# EAGLE design Thermal_Stage_rev (EAGLE 5.06)
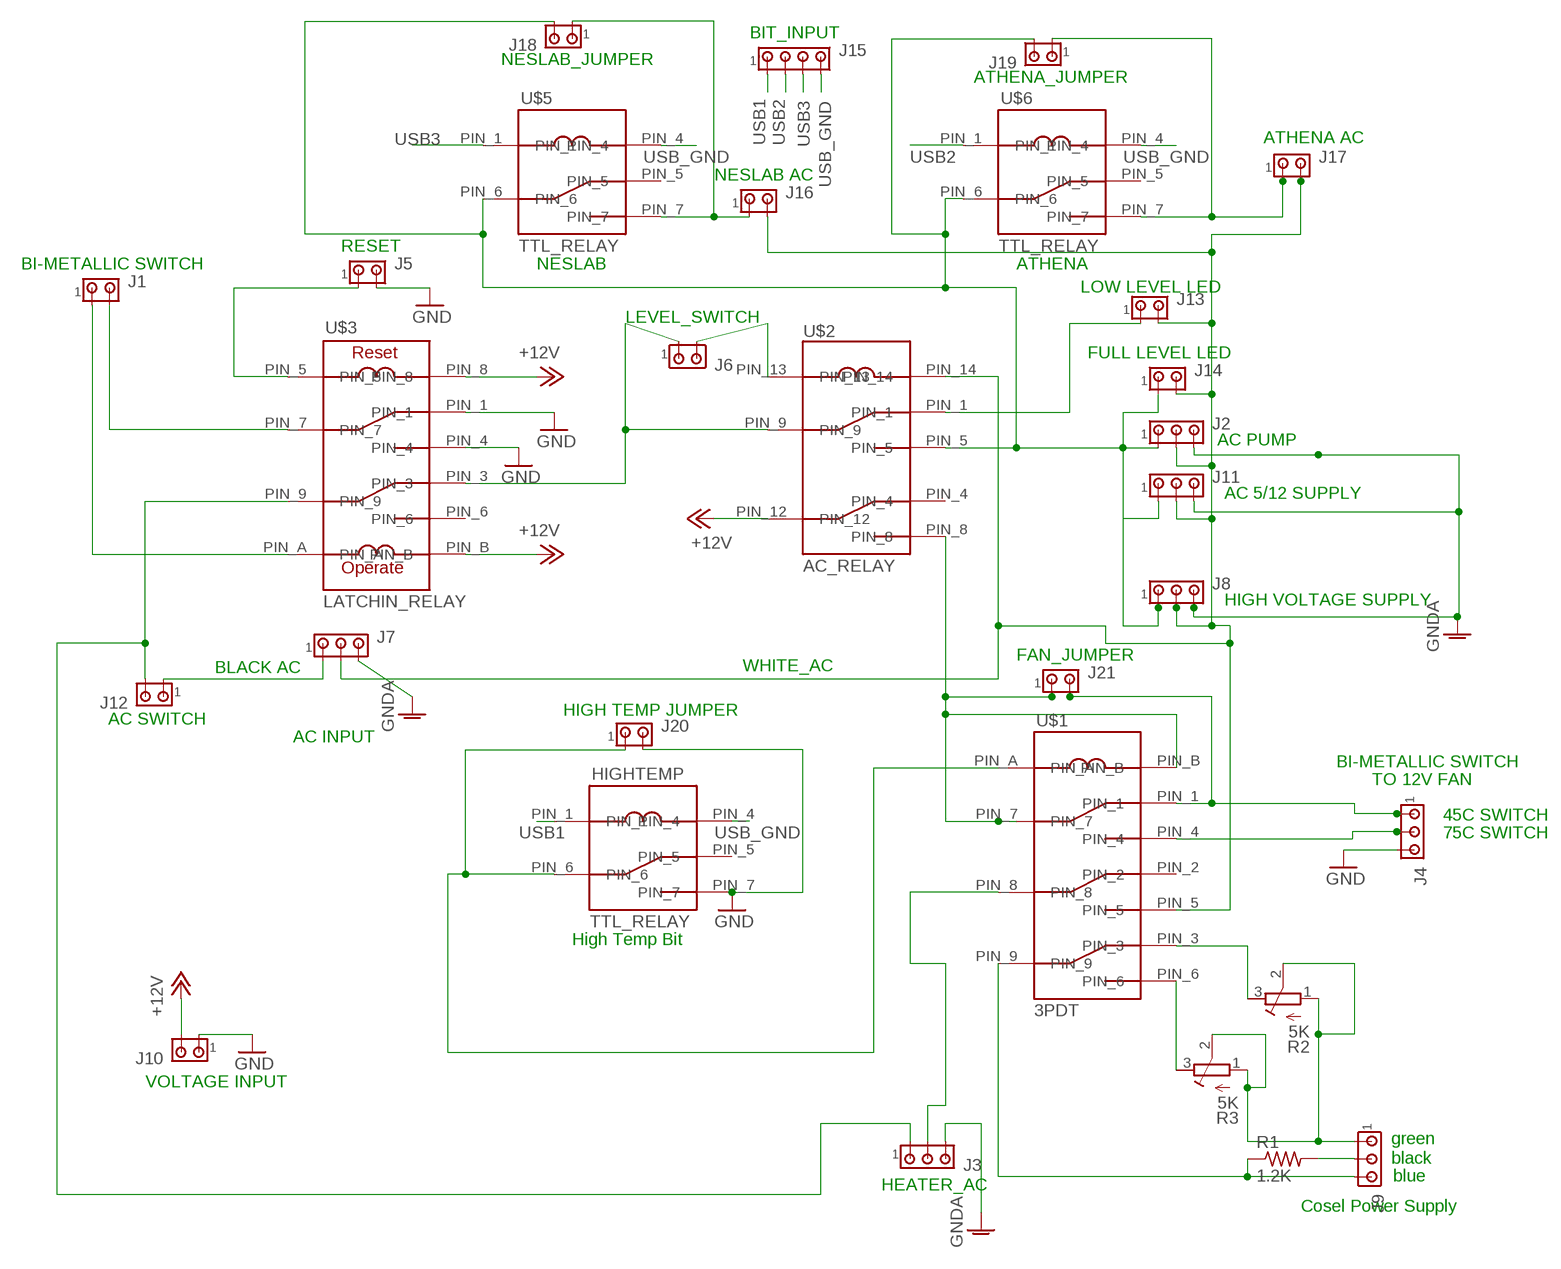
[diagram p0: schematic, sheet 1]

## Parts
HIGHTEMP  TTL_RELAY  [R1OS-E1Y1-J1.0K]
J1  MTA02-156  [1X2MTA]
J2  MTA03-156  [1X3MTA]
J3  MTA03-156  [1X3MTA]
J4  MTA03-156  [1X3MTA]
J5  MTA02-156  [1X2MTA]
J6  MTA02-156  [1X2MTA]
J7  MTA03-156  [1X3MTA]
J8  MTA03-156  [1X3MTA]
J9  MTA03-100  [10X03MTA]
J10  MTA02-156  [1X2MTA]
J11  MTA03-156  [1X3MTA]
J12  MTA02-156  [1X2MTA]
J13  MTA02-156  [1X2MTA]
J14  MTA02-156  [1X2MTA]
J15  MTA04-100  [10X04MTA]
J16  MTA02-156  [1X2MTA]
J17  MTA02-156  [1X2MTA]
J18  MTA02-100  [10X02MTA]
J19  MTA02-100  [10X02MTA]
J20  MTA02-100  [10X02MTA]
J21  MTA02-100  [10X02MTA]
R1  1.2K  R-US_0207/7  [0207/7]
R2  5K  R-TRIMM3296W  [RTRIM3296W]
R3  5K  R-TRIMM3296W  [RTRIM3296W]
U$1  3PDT  [785XBXCD-12D]
U$2  AC_RELAY  [70-402-1]
U$3  LATCHIN_RELAY  [785XBXCD-12D]
U$5  TTL_RELAY  [R1OS-E1Y1-J1.0K]
U$6  TTL_RELAY  [R1OS-E1Y1-J1.0K]

## Nets
+12V: J10.2 U$2.PIN_12 U$3.PIN_8 U$3.PIN_B
BLACK_AC: J7.1 J12.1
BLACK_AC_SWITCH: J3.1 J12.2 U$3.PIN_9
GND: HIGHTEMP.PIN_7 J4.3 J5.2 J10.1 J20.2 U$3.PIN_1 U$3.PIN_4
GNDA: J2.3 J3.3 J7.3 J8.3 J11.3
N$1: J1.2 U$3.PIN_7
N$2: J1.1 U$3.PIN_A
N$4: J5.1 U$3.PIN_5
N$6: J6.1 U$2.PIN_9 U$3.PIN_3
N$8: J2.1 J8.1 J11.1 J14.1 J18.2 J19.2 U$2.PIN_5 U$5.PIN_6 U$6.PIN_6
N$9: J13.1 U$2.PIN_1
N$10: J3.2 U$1.PIN_8
N$11: J6.2 U$2.PIN_13
N$13: HIGHTEMP.PIN_6 J20.1 U$1.PIN_A
N$14: J17.1 J19.1 U$6.PIN_7
N$15: J16.1 J18.1 U$5.PIN_7
N$16: J9.3 R1.1 U$1.PIN_9
N$17: J4.2 U$1.PIN_4
N$18: J4.1 J21.2 U$1.PIN_1
N$19: J9.2 R1.2
N$20: R3.3(A) U$1.PIN_6
N$21: R2.3(A) U$1.PIN_3
N$22: J9.1 R2.1(E) R2.2(S) R3.1(E) R3.2(S)
N$23: J21.1 U$1.PIN_7 U$1.PIN_B U$2.PIN_8
USB1: HIGHTEMP.PIN_1 J15.1
USB2: J15.2 U$6.PIN_1
USB3: J15.3 U$5.PIN_1
USB_GND: HIGHTEMP.PIN_4 J15.4 U$5.PIN_4 U$6.PIN_4
WHITE_AC: J2.2 J7.2 J8.2 J11.2 J13.2 J14.2 J16.2 J17.2 U$1.PIN_5 U$2.PIN_14
Unconnected: HIGHTEMP.PIN_5 U$1.PIN_2 U$2.PIN_4 U$3.PIN_6 U$5.PIN_5 U$6.PIN_5

## Notes on the sheet
- BIT_INPUT
- NESLAB_JUMPER
- ATHENA_JUMPER
- ATHENA AC
- NESLAB AC
- RESET
- BI-METALLIC SWITCH | NESLAB | ATHENA
- LOW LEVEL LED
- LEVEL_SWITCH
- FULL LEVEL LED
- AC PUMP
- AC 5/12 SUPPLY
- HIGH VOLTAGE SUPPLY
- FAN_JUMPER
- BLACK AC | WHITE_AC
- HIGH TEMP JUMPER
- AC SWITCH
- AC INPUT
- BI-METALLIC SWITCH
- TO 12V FAN
- 45C SWITCH
- 75C SWITCH
- High Temp Bit
- VOLTAGE INPUT
- green
- black
- blue
- HEATER_AC
- Cosel Power Supply

## Library data of the parts
HIGHTEMP U$5 U$6 = Anthony-Relay:TTL_RELAY
J1 J5 J6 J10 J12-J14 J16 J17 = con-amp:MTA02-156: AMP connector; OC_FARNELL: unknown; OC_NEWARK: unknown
J2-J4 J7 J8 J11 = con-amp:MTA03-156: AMP connector; OC_FARNELL: unknown; OC_NEWARK: unknown
J9 = con-amp:MTA03-100: AMP connector; OC_FARNELL: unknown; OC_NEWARK: unknown
J15 = con-amp:MTA04-100: AMP connector; OC_FARNELL: unknown; OC_NEWARK: unknown
J18-J21 = con-amp:MTA02-100: AMP connector; OC_FARNELL: unknown; OC_NEWARK: unknown
R1 = rcl:R-US_: RESISTOR, American symbol
R2 R3 = resistor:R-TRIMM: Trimm resistor
U$1 = Anthony-Relay:3PDT
U$2 = Anthony-Relay:AC_RELAY
U$3 = Anthony-Relay:LATCHIN_RELAY

## Board
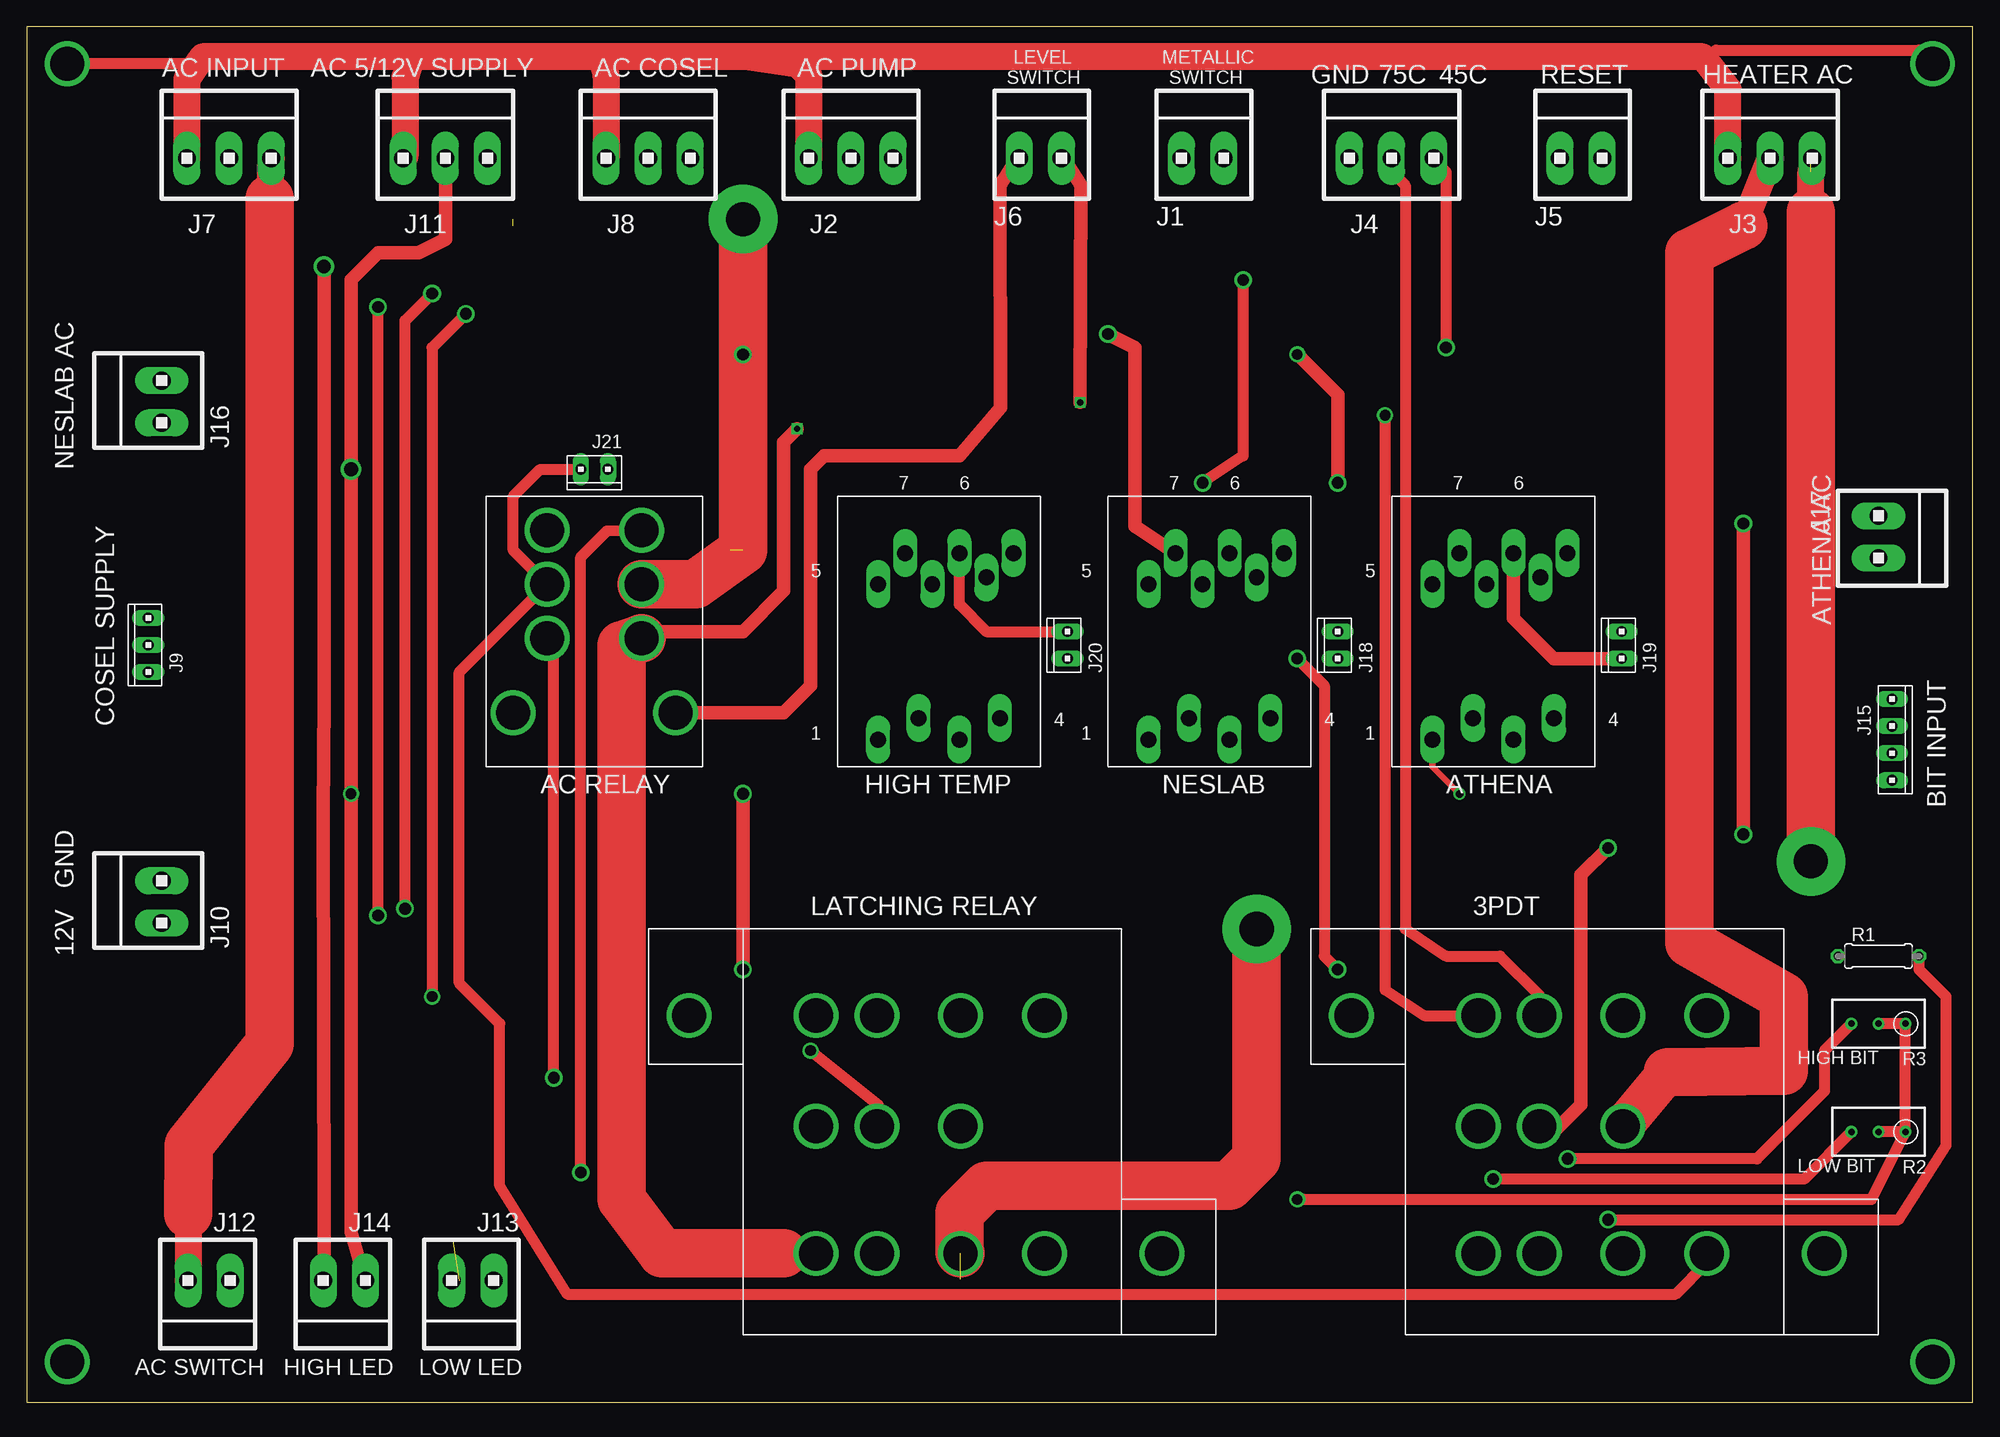
[diagram p1: board, top side]
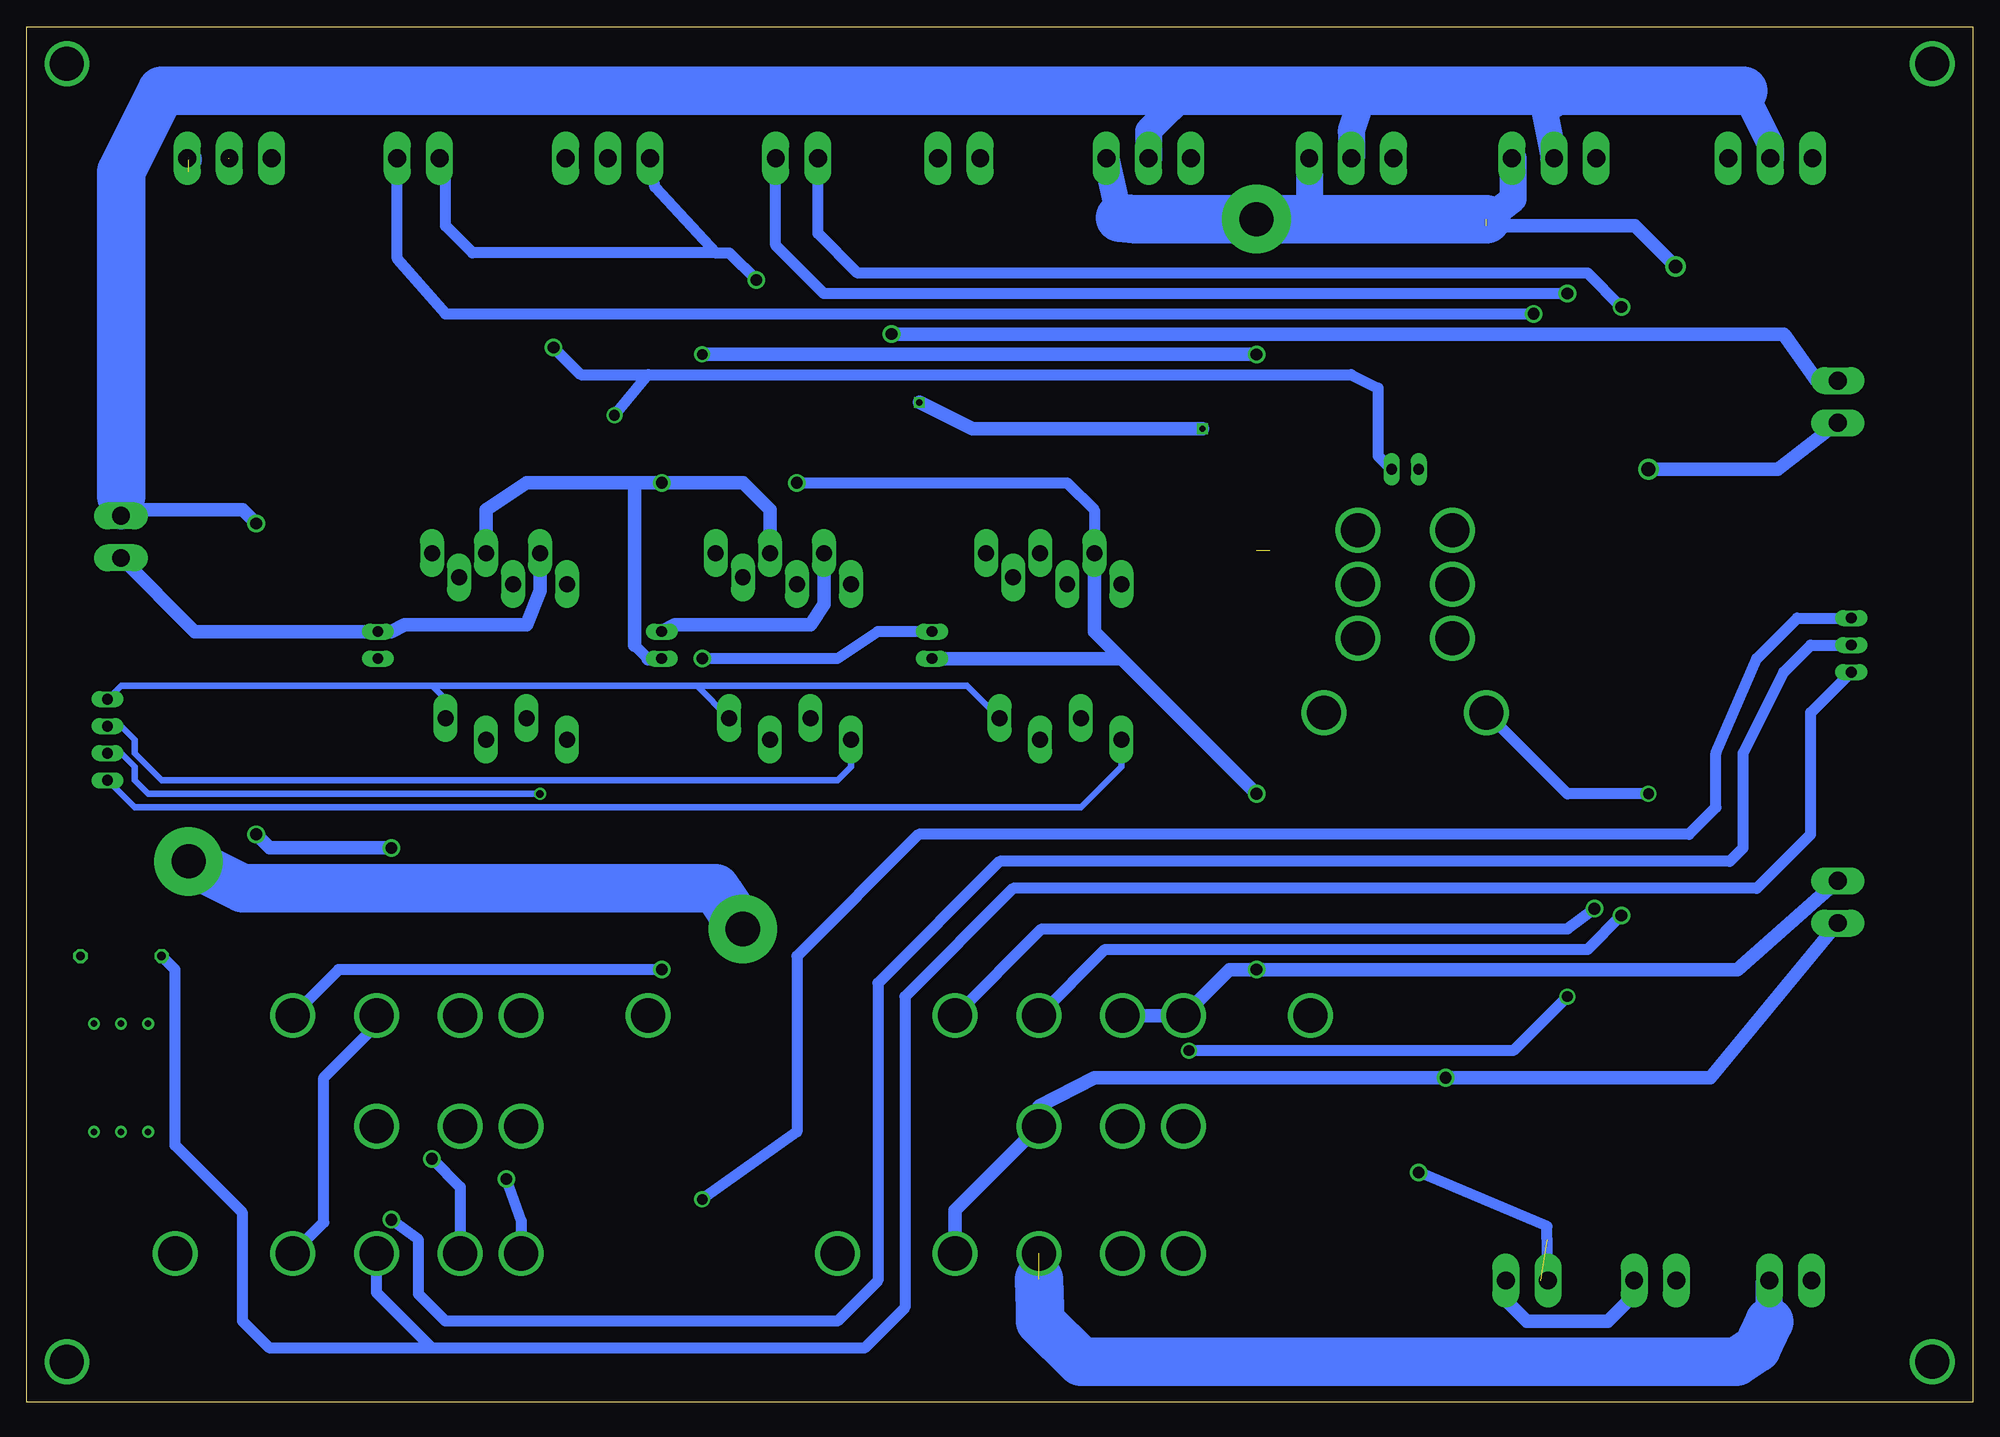
[diagram p2: board, bottom side, seen from below]

Size 182.86 x 129.21 mm. Coordinates in mm from the lower left corner, seen from the top.
Outline: 0,0 182.86,0 182.86,129.21 0,129.21 0,0
Copper layers (1*16): Top 0.035mm / dielectric 1.5mm / Bottom 0.035mm
Design rules "default": minimum track width 10mil, minimum drill 24mil, track to track 8mil, track to pad 8mil, pad to pad 8mil, via to via 8mil, smd to smd 8mil, copper to edge 40mil, drill to drill 8mil, minimum pad ring 10mil, minimum via ring 8mil, stop-mask expansion 4mil, vias tented up to drill 0mil, thermal gap 10mil

### Footprints (pad centres in the part's own frame; a part is rotated, then mirrored left to right if it is on the bottom)
R1OS-E1Y1-J1.0K = drill 1.5 long: 89 8.89,17.145; P$2 7.62,4.572; P$3 11.43,2.54; P$9 13.97,17.78; P$10 16.51,20.066; PIN_1 3.81,2.54; PIN_4 15.24,4.572; PIN_5 3.81,17.145; PIN_6 11.43,20.066; PIN_7 6.35,20.066
1X2MTA = drill 1.676 long: 1 1.981,0; 2 -1.981,0
1X3MTA = drill 1.676 long: 1 3.937,0; 2 -0.025,0; 3 -3.988,0
10X03MTA = drill 1.016 long: 1 2.54,0; 2 0,0; 3 -2.54,0
10X04MTA = drill 1.016 long: 1 3.81,0; 2 1.27,0; 3 -1.27,0; 4 -3.81,0
10X02MTA = drill 1.016 long: 1 1.27,0; 2 -1.27,0
0207/7 = drill 0.813 octagon: 1 -3.81,0; 2 3.81,0
RTRIM3296W = drill 0.61 round: 1 0,-2.54; 2 0,0; 3 0,2.54
785XBXCD-12D = drill 3.2 round: P$6 7.62,-3.81; P$14 29.972,40.64; PIN_1 29.972,28.702; PIN_2 19.558,28.702; PIN_3 7.62,28.702; PIN_4 29.972,22.987; PIN_5 19.558,22.987; PIN_6 7.62,22.987; PIN_7 29.972,15.113; PIN_8 19.558,15.113; PIN_9 7.62,15.113; PIN_A 29.972,7.239; PIN_B 7.62,7.239
70-402-1 = drill 3.2 round: PIN_1 5.715,3.175; PIN_4 14.605,3.175; PIN_5 5.715,8.255; PIN_8 14.605,8.255; PIN_9 5.715,13.335; PIN_12 14.605,13.335; PIN_13 2.54,20.32; PIN_14 17.78,20.32

### Placement (x,y rotation side)
HIGHTEMP  76.2,59.69 0 top
J1  110.49,116.84 0 top
J2  77.47,116.84 0 top
J3  163.83,116.84 0 top
J4  128.27,116.84 0 top
J5  146.05,116.84 0 top
J6  95.25,116.84 0 top
J7  19.05,116.84 0 top
J8  58.42,116.84 0 top
J9  11.43,71.12 90 top
J10  12.7,46.99 90 top
J11  39.37,116.84 0 top
J12  17.14,11.43 180 top
J13  41.91,11.43 180 top
J14  29.84,11.43 180 top
J15  175.26,62.23 270 top
J16  12.7,93.98 90 top
J17  173.99,81.28 270 top
J18  123.19,71.12 90 top
J19  149.86,71.12 90 top
J20  97.79,71.12 90 top
J21  53.34,87.63 180 top
R1  173.99,41.91 0 top
R2  173.99,25.4 90 top
R3  173.99,35.56 90 top
U$1  165.1,6.35 90 top
U$2  63.5,85.09 180 top
U$3  102.87,6.35 90 top
U$5  101.6,59.69 0 top
U$6  128.27,59.69 0 top

### Tracks (layer width: path | path; a pad name or v marks a point on that pad's centre or on a via)
+12V  (via drill 1.1)
  Top 1.016: U$2.PIN_12 49.53,71.12 v49.53,30.48
  Bottom 1.27: J10.2 24.69,30.48 v49.53,30.48 82.55,30.48 87.76,27.81 U$3.PIN_8 95.63,18.03 U$3.PIN_B
BLACK_AC
  Top 2.54: 22.86,113.03 J7.1 | 15.16,17.7 J12.1
  Top 4.572: 22.86,113.03 22.86,33.66 15.24,24.13 15.16,17.7
BLACK_AC_SWITCH  (via drill 3.2 pad 6.45)  (2 unrouted)
  Top 2.54: 167.64,111.76 167.64,115.57
  Top 4.572: 167.64,111.76 v167.64,50.8 | v115.57,44.45 115.57,22.86 113.03,20.32 90.17,20.32 87.63,17.78 87.63,14.1 U$3.PIN_9
  Bottom 2.54: 19.13,7.54 J12.2 | 167.64,116.71 J3.1
  Bottom 4.572: 19.13,7.54 20.32,5.08 22.23,3.81 83.82,3.81 87.63,7.62 87.63,8.89 87.76,11.56 | v115.57,44.45 118.11,48.26 162.56,48.26 v167.64,50.8
GND  (via drill 1.1)
  Top 1.016: v114.3,105.41 114.3,88.9 v110.49,86.36
  Top 1.27: v67.31,57.15 v67.31,40.64
  Bottom 1.016: J4.3 123.83,114.12 118.11,107.95 | 118.11,107.95 116.84,107.95 v114.3,105.41 | v110.49,86.36 85.09,86.36 82.55,83.82 HIGHTEMP.PIN_7 | J5.2 143.51,116.84 143.51,110.49 140.97,107.95 118.11,107.95
  Bottom 1.27: J10.1 22.15,40.64 v67.31,40.64 69.85,40.64 U$3.PIN_1 U$3.PIN_4 | HIGHTEMP.PIN_7 82.55,72.39 80.01,69.85 | 80.01,69.85 v67.31,57.15 | 80.01,69.85 J20.2
GNDA
  Top 2.54: J7.3 15.06,124.28 16.51,126.36 36.2,126.36 | 36.2,126.36 35.56,124.46 35.56,117.02 J11.3 | J8.3 54.43,124.64 53.98,126.36 | 53.98,126.36 36.2,126.36 | J2.3 73.48,124.64 72.39,125.73 67.94,126.36 | 67.94,126.36 53.98,126.36 | J3.3 159.84,123.37 157.48,126.36 67.94,126.36
N$1  (via drill 1.1)
  Top 1.016: v33.02,45.72 v33.02,102.87
  Bottom 1.016: U$3.PIN_7 81.53,42.55 36.2,42.55 v33.02,45.72 | v33.02,102.87 36.2,106.05 104.78,106.05 108.51,109.78 J1.2
N$2  (via drill 1.1)
  Top 1.016: v35.56,46.35 35.56,101.6 v38.1,104.14
  Bottom 1.016: U$3.PIN_A 87.5,44.45 38.1,44.45 v35.56,46.35 | v38.1,104.14 107.95,104.14 112.47,108.66 J1.1
N$4  (via drill 1, 1.1)
  Top 1.016: v73.66,33.02 80.01,27.94 80.01,26.04 U$3.PIN_5 | v38.1,38.1 38.1,99.06 v41.27,102.23
  Bottom 1.016: v73.66,33.02 43.18,33.02 v38.1,38.1 | v41.27,102.23 143.51,102.23 148.03,107.39 J5.1
N$6  (via drill 0.6)
  Top 1.27: 57.15,71.12 U$2.PIN_9 58.42,72.39 67.31,72.39 71.12,76.2 71.12,90.17 v72.39,91.44 | v98.98,93.9 99.06,114.3 97.79,116.28 J6.1
  Top 2.54: 71.12,13.97 U$3.PIN_3
  Top 4.572: 71.12,13.97 59.69,13.97 55.88,19.05 55.88,71.12 U$2.PIN_9
  Bottom 1.27: v98.98,93.9 93.98,91.44 v72.39,91.44
N$8  (via drill 1, 1.1, 1.3, 3.2 pad 6.45)  (2 unrouted)
  Top 1.27: J14.1 27.94,11.43 27.94,15.24 | 27.94,15.24 27.94,15.88 | 27.94,15.24 27.94,16.51 27.86,55.17 27.94,66.04 v27.94,106.68 | v119.38,98.42 123.19,94.61 123.19,91.44 v123.19,86.36 | J19.2 143.51,69.85 139.7,73.66 U$6.PIN_6
  Top 4.572: v67.31,111.12 v67.31,98.42 67.31,80.01 62.87,76.83 U$2.PIN_5
  Bottom 1.016: 125.73,71.12 124.46,69.85
  Bottom 1.27: 43.18,116.84 J11.1 | v27.94,106.68 31.75,110.49 45.72,110.49 | U$6.PIN_6 139.7,83.82 135.89,86.36 125.73,86.36 | 125.73,86.36 v123.19,86.36 115.57,86.36 113.03,83.82 U$5.PIN_6 | v67.31,98.42 v119.38,98.42 | 124.46,69.85 J18.2 | 125.73,86.36 125.73,71.12
  Bottom 2.54: 62.23,111.12 J8.1 | 80.14,111.25 J2.1 | 43.18,116.84 43.18,113.03 45.72,111.12
  Bottom 4.572: 62.23,111.12 v67.31,111.12 78.74,111.12 80.14,111.25 | 62.23,111.12 45.72,111.12 | 62.23,111.12 64.77,111.12
N$9  (via drill 1.1)  (1 unrouted)
  Top 1.016: v52.07,21.59 52.07,79.38 54.53,81.84 56.52,81.92 U$2.PIN_1
  Bottom 1.016: 40.01,15.32 40.01,16.51 v52.07,21.59 | 40.01,15.32 40.01,15.24 | 40.01,15.32 40.01,11.51 J13.1
N$10  (1 unrouted)
  Top 2.54: J3.2 163.83,116.84 | 161.29,110.49 163.83,116.81
  Top 3.81: 154.18,30.99 U$1.PIN_8
  Top 4.572: 154.18,30.99 165.1,31.11 165.1,38.1 156.21,43.18 156.21,107.95 161.29,110.49
N$11
  Top 1.27: J6.2 92.71,116.28 91.44,114.3 91.52,93.42 87.63,88.9 74.93,88.9 73.66,87.63 73.66,67.31 71.12,64.77 U$2.PIN_13
N$13  (via drill 1.1)
  Top 1.016: HIGHTEMP.PIN_6 87.63,74.93 90.17,72.39 J20.1 | v119.38,69.85 121.92,67.31 121.92,41.91 v123.19,40.64
  Bottom 1.016: J20.1 102.87,72.39 106.68,69.85 v119.38,69.85 | v123.19,40.64 153.54,40.64 U$1.PIN_A
N$14
  Bottom 1.27: J17.1 167.08,72.39 J19.1 148.59,72.39 147.32,73.03 135.89,73.03 134.62,76.2 U$6.PIN_7
N$15  (via drill 1.1)
  Top 1.27: U$5.PIN_7 104.14,82.3 104.14,99.06 v101.6,100.33
  Bottom 1.27: J18.1 121.92,73.03 109.22,73.03 107.95,74.93 U$5.PIN_7 | v101.6,100.33 17.78,100.33 14.68,95.96 J16.1
N$16
  Bottom 1.016: J9.3 15.24,64.77 15.24,53.34 20.32,48.26 90.17,48.26 100.33,38.1 100.33,8.89 104.14,5.08 142.24,5.08 | 142.24,5.08 144.78,5.08 149.99,10.29 U$1.PIN_9 | R1.1 168.91,40.64 168.91,24.13 162.56,17.78 162.56,7.62 160.02,5.08 142.24,5.08
N$17
  Top 1.016: J4.2 128.27,116.81 128.27,115.57 129.54,114.3 129.54,44.45 133.35,41.91 138.43,41.91 142.11,38.23 U$1.PIN_4
N$18  (via drill 1, 1.1)
  Top 1.016: v127.64,92.71 127.64,38.73 131.32,36.32 U$1.PIN_1 | J4.1 132.08,116.84 133.35,115.57 v133.35,99.06
  Bottom 1.016: J21.2 55.88,88.9 55.88,95.25 58.42,96.52 124.46,96.52 | 124.46,96.52 v127.64,92.71 | v133.35,99.06 130.81,96.52 124.46,96.52
N$19  (via drill 1.1)
  Top 1.016: v148.59,17.14 175.9,17.14 180.34,24.13 180.34,38.1 177.8,40.64 R1.2
  Bottom 1.016: J9.2 15.24,71.12 17.78,68.58 21.59,60.96 21.59,52.07 22.86,50.8 91.44,50.8 102.87,39.37 102.87,11.43 106.68,7.62 143.51,7.62 146.05,10.16 146.05,15.24 v148.59,17.14
N$20  (via drill 1.1)
  Top 1.016: R3.3 168.91,33.02 168.91,29.21 162.56,22.86 v144.78,22.86
  Bottom 1.016: v144.78,22.86 142.11,20.19 U$1.PIN_6
N$21  (via drill 1.1)
  Top 1.016: R2.3 167,20.95 v137.79,20.95
  Bottom 1.016: v137.79,20.95 136.4,17.02 U$1.PIN_3
N$22  (via drill 1)
  Top 1.016: v119.38,19.05 173.35,19.05 R2.1 | R2.1 R3.1 R3.2 | R2.1 R2.2
  Bottom 1.016: J9.1 16.51,73.66 20.32,69.85 24.13,60.96 24.13,55.88 26.67,53.34 99.06,53.34 110.49,41.91 110.49,25.4 v119.38,19.05
N$23
  Top 1.016: U$1.PIN_B 157.86,13.08 154.94,10.16 50.8,10.16 44.45,20.32 44.45,35.56 40.64,39.37 40.64,68.58 U$2.PIN_8 45.72,80.01 45.72,85.09 48.26,87.63 J21.1
  Bottom 1.016: U$1.PIN_B 154.94,16.89 154.94,30.48 149.99,35.43 U$1.PIN_7
S$1  (via drill 3.2 pad 1.27)
  other vias: 179.07,125.73
S$2  (via drill 3.2 pad 1.27)
  other vias: 3.81,125.73
S$3  (via drill 3.2 pad 1.27)
  other vias: 3.81,3.81
S$4  (via drill 3.2 pad 1.27)
  other vias: 179.07,3.81
S$5
  Top 1.016: 15.24,125.73 5.08,125.73
S$6
  Top 1.016: 158.75,127 177.8,127
USB1
  Bottom 0.61: J15.1 172.72,55.88 83.82,55.88 80.01,59.69 HIGHTEMP.PIN_1
USB2  (via drill 0.7)
  Top 0.61: v134.62,57.15 132.08,59.69 U$6.PIN_1
  Bottom 0.61: J15.2 173.99,60.96 172.72,59.69 172.72,58.42 171.45,57.15 v134.62,57.15
USB3
  Bottom 0.61: J15.3 173.99,63.5 172.72,62.23 172.72,60.96 170.18,58.42 106.68,58.42 105.41,59.69 U$5.PIN_1
USB_GND
  Bottom 0.61: J15.4 173.99,67.31 144.78,67.31 | 144.78,67.31 143.51,66.04 U$6.PIN_4 | U$5.PIN_4 119.89,67.31 120.65,67.31 | 120.65,67.31 144.78,67.31 | HIGHTEMP.PIN_4 94.49,67.31 120.65,67.31
WHITE_AC  (via drill 1, 1.1, 1.3)
  Top 1.016: 39.37,114.3 39.37,116.81 J11.2
  Top 1.27: v161.29,82.55 v161.29,53.34 | v148.59,52.07 146.05,49.53 146.05,27.94 143.51,25.4 142.24,25.4 142.11,25.53 U$1.PIN_5 | J14.2 30.48,15.95 v30.48,57.15 v30.48,87.63 30.48,105.41 33.02,107.95 36.83,107.95 39.37,109.22 39.37,114.3
  Bottom 1.016: U$2.PIN_14 38.1,57.15 v30.48,57.15
  Bottom 1.27: J17.2 173.43,83.82 162.56,83.82 v161.29,82.55 | v161.29,53.34 160.02,52.07 v148.59,52.07 | J2.2 77.47,116.84 | 58.42,119.38 58.4,119.36 | J16.2 18.34,87.63 v30.48,87.63 | J14.2 31.83,10.08 34.29,7.62 41.91,7.62 44.45,10.16 44.45,10.87 J13.2
  Bottom 2.54: J2.2 77.44,119.41 73.66,123.19 | 57.15,123.19 58.42,119.38 | J11.2 39.37,116.86 40.64,123.19 39.34,121.89 | 21.59,123.19 19.05,118.14 J7.2 | 58.4,119.36 J8.2 | J17.2 173.99,85.09
  Bottom 4.572: 21.59,123.19 40.64,123.19 57.15,123.19 73.66,123.19 170.18,123.19 173.99,115.57 173.99,85.09

### Text on the board
tPlace: LEVEL | METALLIC | AC INPUT | AC 5/12V SUPPLY | AC COSEL | AC PUMP | SWITCH | SWITCH | GND | 75C | 45C | RESET | HEATER AC | NESLAB AC | ATHENA AC | COSEL SUPPLY | AC RELAY | HIGH TEMP | NESLAB | ATHENA | BIT INPUT | GND | LATCHING RELAY | 3PDT | 12V | HIGH BIT | LOW BIT | AC SWITCH | HIGH LED | LOW LED